# EAGLE design Omni-BASIC-BOTTOM (EAGLE 9.6.2)
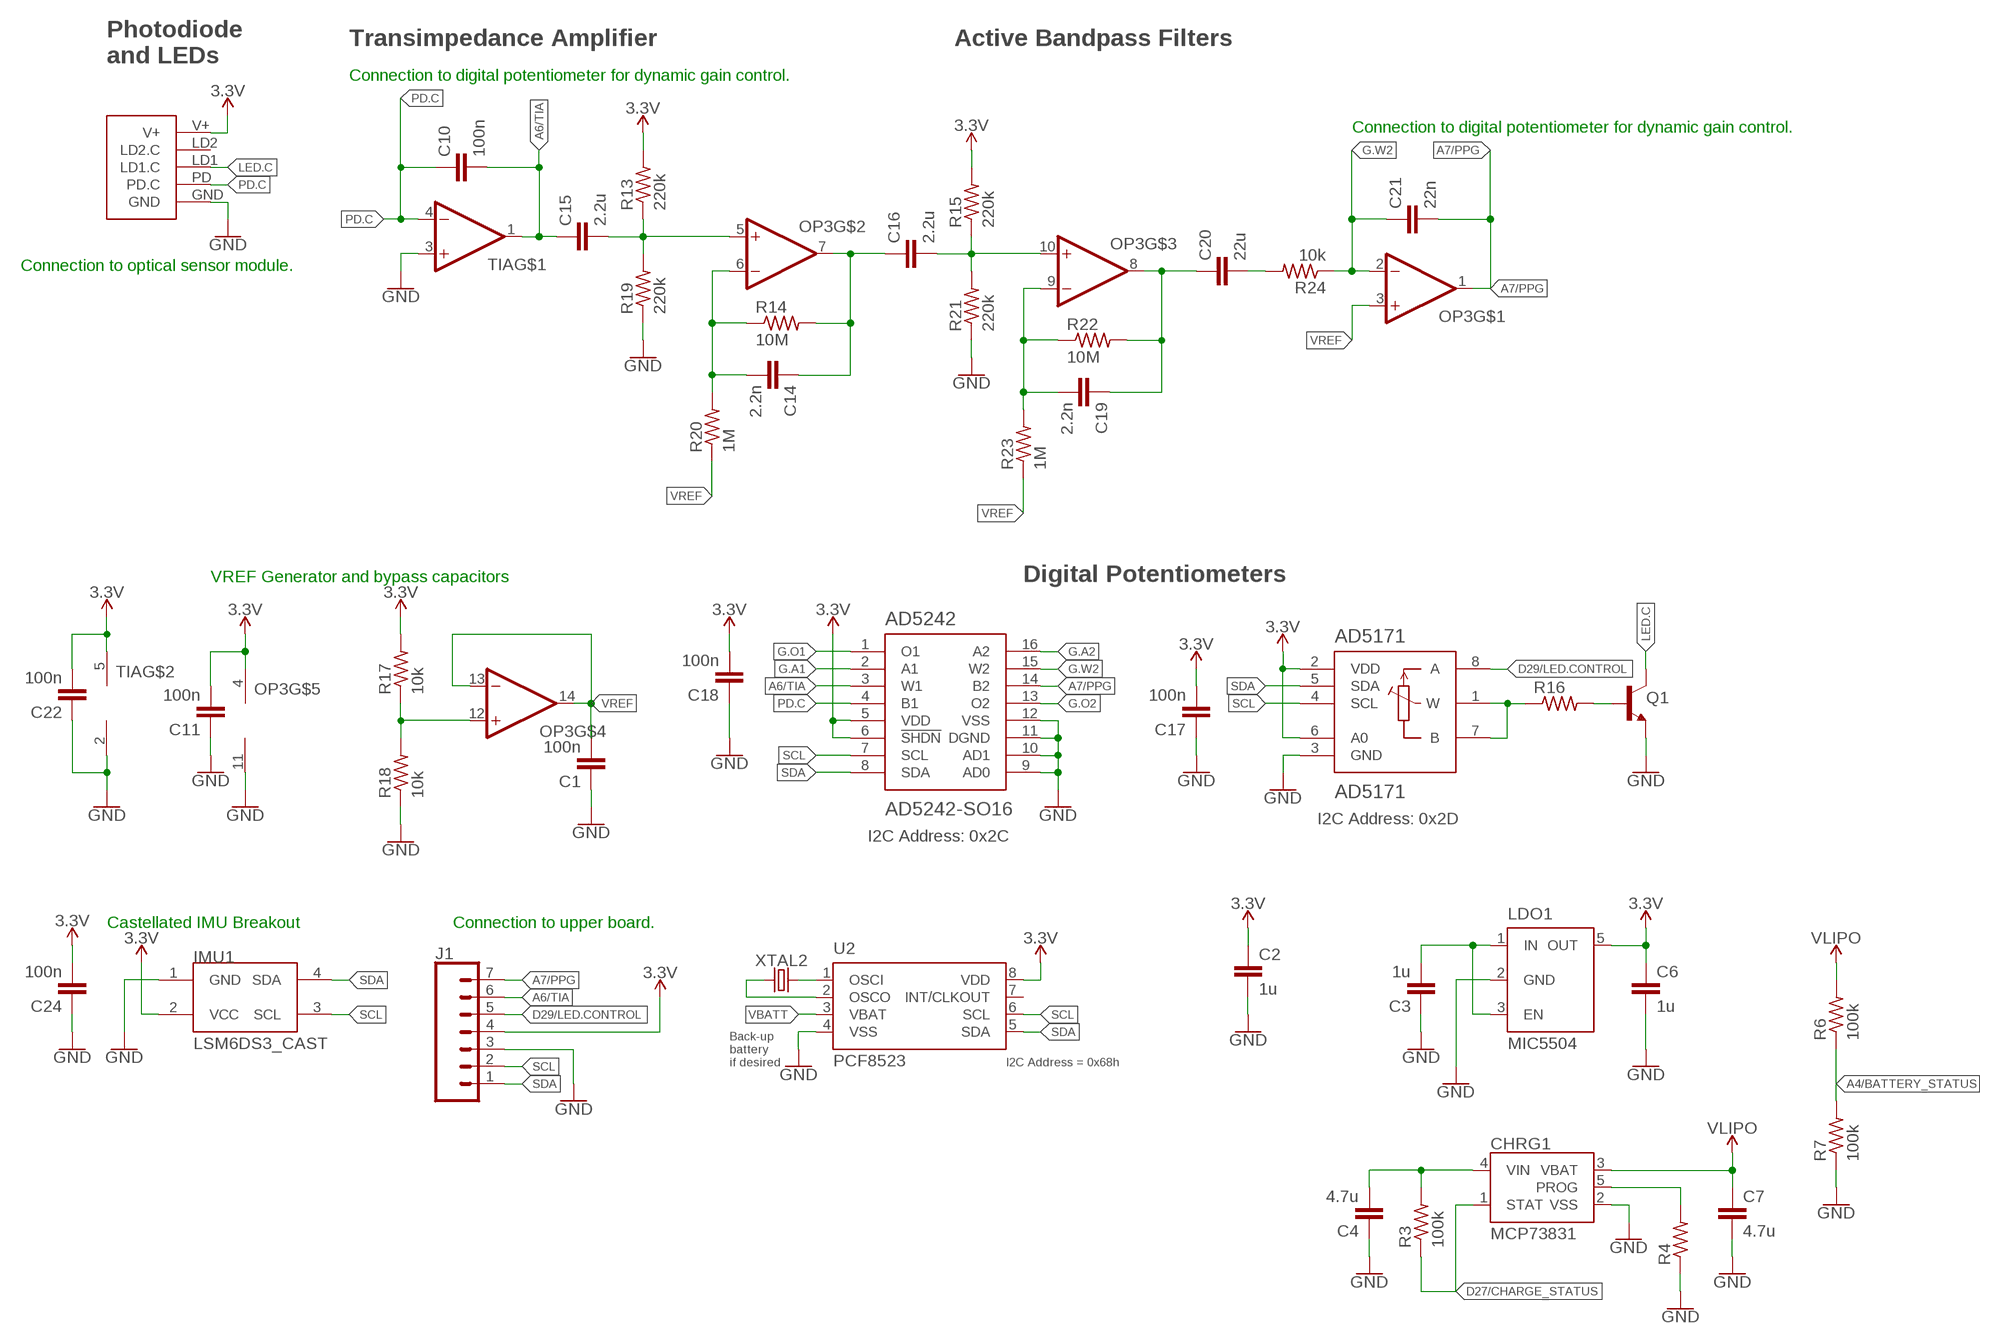
[diagram p0: schematic, sheet 1]

## Parts
AD5171  AD5171  [SOT-23-8]
AD5242  AD5242-SO16  [SO16]
C1  100n  CAPACITOR0603  [C0603]
C2  1u  CAPACITOR0603  [C0603]
C3  1u  CAPACITOR0603  [C0603]
C4  4.7u  CAPACITOR0603  [C0603]
C6  1u  CAPACITOR0603  [C0603]
C7  4.7u  CAPACITOR0603  [C0603]
C10  100n  CAPACITOR0603  [C0603]
C11  100n  CAPACITOR0603  [C0603]
C14  2.2n  CAPACITOR0603  [C0603]
C15  2.2u  CAPACITOR0603  [C0603]
C16  2.2u  CAPACITOR0603  [C0603]
C17  100n  CAPACITOR0603  [C0603]
C18  100n  CAPACITOR0603  [C0603]
C19  2.2n  CAPACITOR0603  [C0603]
C20  22u  CAPACITOR0603  [C0603]
C21  22n  CAPACITOR0603  [C0603]
C22  100n  CAPACITOR0603  [C0603]
C24  100n  CAPACITOR0603  [C0603]
CHRG1  MCP73831  [SOT23-5]
IMU1  LSM6DS3_CAST  [LSM6DS3_CAST]
J1  CONN_07-1.27MM  [1X07_1.27MM]
LDO1  MIC5504  [SOT23-5]
OP3  OP-QUAD-SO14  [SO14]
Q1  NPN-GENERIC  [SOT23-3]
R3  100k  RESISTOR0603  [R0603]
R4  RESISTOR0603  [R0603]
R6  100k  RESISTOR0603  [R0603]
R7  100k  RESISTOR0603  [R0603]
R13  220k  RESISTOR0603  [R0603]
R14  10M  RESISTOR0603  [R0603]
R15  220k  RESISTOR0603  [R0603]
R16  RESISTOR0603  [R0603]
R17  10k  RESISTOR0402  [R0402]
R18  10k  RESISTOR0402  [R0402]
R19  220k  RESISTOR0603  [R0603]
R20  1M  RESISTOR0603  [R0603]
R21  220k  RESISTOR0603  [R0603]
R22  10M  RESISTOR0603  [R0603]
R23  1M  RESISTOR0603  [R0603]
R24  10k  RESISTOR0603  [R0603]
TIA  OP-SINGLEOT  [SOT23-5]
U2  PCF8523  [SO8]
U$3  PPG.MODULE.2  [PPG.MODULE.2]
XTAL2  32.7680kHz  CRYSTALECS-.327-12.5-12-C-TR  [2-SMD.NOLEAD.2.0MMTO1.2MM]

## Nets
3.3V: AD5171.2(VDD) AD5171.6(A0) AD5242.5(VDD) AD5242.6(!SHDN) C2.1 C6.1 C11.2 C17.2 C18.2 C22.2 C24.2 IMU1.2(VCC) J1.4 LDO1.5(OUT) OP3.4(V+) R13.2 R15.2 R17.2 TIA.5(V+) U2.8(VDD) U$3.V+
A4/BATTERY_STATUS: R6.1 R7.2
A6/TIA: AD5242.3(W1) C10.2 C15.1 J1.6 TIA.1(OUT)
A7/PPG: AD5242.14(B2) C21.2 J1.7 OP3.1(OUT)
D27/CHARGE_STATUS: CHRG1.1(STAT) R3.1
D29/LED.CONTROL: AD5171.8(A) J1.5
G.A1: AD5242.2(A1)
G.A2: AD5242.16(A2)
G.O1: AD5242.1(O1)
G.O2: AD5242.13(O2)
G.W2: AD5242.15(W2) C21.1 OP3.2(-IN) R24.1
GND: AD5171.3(GND) AD5242.9(AD0) AD5242.10(AD1) AD5242.11(DGND) AD5242.12(VSS) C1.1 C2.2 C3.1 C4.1 C6.2 C7.2 C11.1 C17.1 C18.1 C22.1 C24.1 CHRG1.2(VSS) IMU1.1(GND) J1.3 LDO1.2(GND) OP3.11(V-) Q1.2(E) R4.1 R7.1 R18.1 R19.1 R21.1 TIA.2(V-) TIA.3(+IN) U2.4(VSS) U$3.GND
LED.C: Q1.3(C) U$3.LD1(LD1.C)
N$3: U2.2(OSCO) XTAL2.P$1
N$4: U2.1(OSCI) XTAL2.P$2
N$5: CHRG1.5(PROG) R4.2
N$6: C3.2 LDO1.1(IN) LDO1.3(EN)
N$8: Q1.1(B) R16.2
N$9: AD5171.1(W) AD5171.7(B) R16.1
N$10: OP3.12(+IN) R17.1 R18.2
N$13: C15.2 OP3.5(+IN) R13.1 R19.2
N$15: C14.2 OP3.6(-IN) R14.1 R20.2
N$16: C14.1 C16.1 OP3.7(OUT) R14.2
N$17: C16.2 OP3.10(+IN) R15.1 R21.2
N$18: C19.2 OP3.9(-IN) R22.1 R23.2
N$19: C19.1 C20.1 OP3.8(OUT) R22.2
N$20: C20.2 R24.2
PD.C: AD5242.4(B1) C10.1 TIA.4(-IN) U$3.PD(PD.C)
SCL: AD5171.4(SCL) AD5242.7(SCL) IMU1.3(SCL) J1.2 U2.6(SCL)
SDA: AD5171.5(SDA) AD5242.8(SDA) IMU1.4(SDA) J1.1 U2.5(SDA)
VBATT: U2.3(VBAT)
VIN1: C4.2 CHRG1.4(VIN) R3.2
VLIPO: C7.1 CHRG1.3(VBAT) R6.2
VREF: C1.2 OP3.3(+IN) OP3.13(-IN) OP3.14(OUT) R20.1 R23.1
Unconnected: U2.7(INT/CLKOUT) U$3.LD2(LD2.C)

## Notes on the sheet
- Transimpedance Amplifier | Active Bandpass Filters
- Photodiode
  and LEDs
- Connection to digital potentiometer for dynamic gain control.
- Connection to digital potentiometer for dynamic gain control.
- Connection to optical sensor module.
- VREF Generator and bypass capacitors | Digital Potentiometers
- I2C Address: 0x2D
- I2C Address: 0x2C
- Castellated IMU Breakout | Connection to upper board.
- Back-up
  battery
  if desired
- I2C Address = 0x68h

## Library data of the parts
AD5171 = LinnesLab-DigitalIC:AD5171
AD5242 = LinnesLab-DigitalIC:AD5242
C1-C4 C6 C7 C10 C11 C14-C22 C24 = LinnesLab-Passives:CAPACITOR
CHRG1 = LinnesLab-Power:MCP73831: MCP73831T Li-Ion, Li-Pol Controller Miniature single cell, fully integrated Li-Ion, Li-polymer charge management controller Datasheet <http://ww1.microchip.com/downloads/en/DeviceDoc/20001984g.pdf> SparkFun Products: SparkFun ESP32 Thing <https://www.sparkfun.com/products/13907> SparkFun 9DoF Razor IMU M0 <https://www.sparkfun.com/products/14001>; PROD_ID: IC-09995
IMU1 = LinnesLab-Sensors:LSM6DS3_CAST
J1 = LinnesLab-Connectors:CONN_07: Multi connection point. Often used as Generic Header-pin footprint for 0.1 inch spaced/style header connections On any of the 0.1 inch spaced packages, you can populate with these: Break Away Headers - Straight <https://www.sparkfun.com/products/116> (PRT-00116) Break Away Male Headers - Right Angle <https://www.sparkfun.com/products/553> (PRT-00553) Female Headers <https://www.sparkfun.com/products/115> (PRT-00115) Break Away Headers - Machine Pin <https://www.sparkfun.com/products/117> (PRT-00117) Break Away Female Headers - Swiss Machine Pin <https://www.sparkfun.com/products/743> (PRT-00743) For SCREWTERMINALS and SPRING TERMINALS visit here: Screw Terimnals on SparkFun.com <https://www.sparkfun.com/search/results?term=Screw+Terminals> (5mm/3.5mm/2.54mm spacing) This device is also useful as a general connection point to wire up your design to another part of your project. Our various solder wires solder well into these plated through hole pads. Hook-Up Wire - Assortment (Stranded, 22 AWG) <https://www.sparkfun.com/products/11375> (PRT-11375) Hook-Up Wire - Assortment (Solid Core, 22 AWG) <https://www.sparkfun.com/products/11367> (PRT-11367) View the entire wire category on our website here <https://www.sparkfun.com/categories/141> Special notes: Molex polarized connector foot print use with SKU : PRT-08231 with associated crimp pins and housings. 1MM SMD Version SKU: PRT-10208 NOTES ON THE VARIANTS LOCK and LOCK_LONGPADS... This footprint was designed to help hold the alignment of a through-hole component (i.e. 6-pin header) while soldering it into place. You may notice that each hole has been shifted either up or down by 0.005 of an inch from it's more standard position (which is a perfectly straight line). This slight alteration caused the pins (the squares in the middle) to touch the edges of the holes. Because they are alternating, it causes a "brace" to hold the component in place. 0.005 has proven to be the perfect amount of "off-center" position when using our standard breakaway headers. Although looks a little odd when you look at the bare footprint, once you have a header in there, the alteration is very hard to notice. Also,if you push a header all the way into place, it is covered up entirely on the bottom side.
LDO1 = LinnesLab-Power:MIC5504: MIC5504 Voltage Regulator Output Voltages: 1.0V to 3.3V Input Voltages: 2.5V to 5.5V Link to Datasheet http://ww1.microchip.com/downloads/en/DeviceDoc/MIC550X.pdf
OP3 = LinnesLab-AnalogIC:OP-QUAD: General symbol and footprints for Quad Op Amps. Use with any standard general purpose op amp.
Q1 = LinnesLab-DiscreteSemi:NPN
R3 R4 R6 R7 R13-R24 = LinnesLab-Passives:RESISTOR
TIA = LinnesLab-AnalogIC:OP-SINGLE: Single Op Amp 2.7V to 6.0V Single Supply CMOS Source: http://ww1.microchip.com/downloads/en/DeviceDoc/21314g.pdf
U2 = LinnesLab-Clocks:PCF8523; DIGIKEY: 568-5306-1-ND; I2C_ADDRESS: 0x68h; MFN: PCF8523T/1,118; MFN_MANUFACTURER: NXP USA Inc.
U$3 = LinnesLab-Connectors:PPG.MODULE.2: Digi-Key Part Number: S9014E-50-ND Manufacturer Part Number: GRPB501VWVN-RC Description: 1mm insulation height 0.05in pitch 50 positions
XTAL2 = LinnesLab-Clocks:CRYSTAL; DIGIKEY: XC2288CT-ND; FREQ: 32.7680KHZ; LOAD_CAP: 12.5pF

## Board
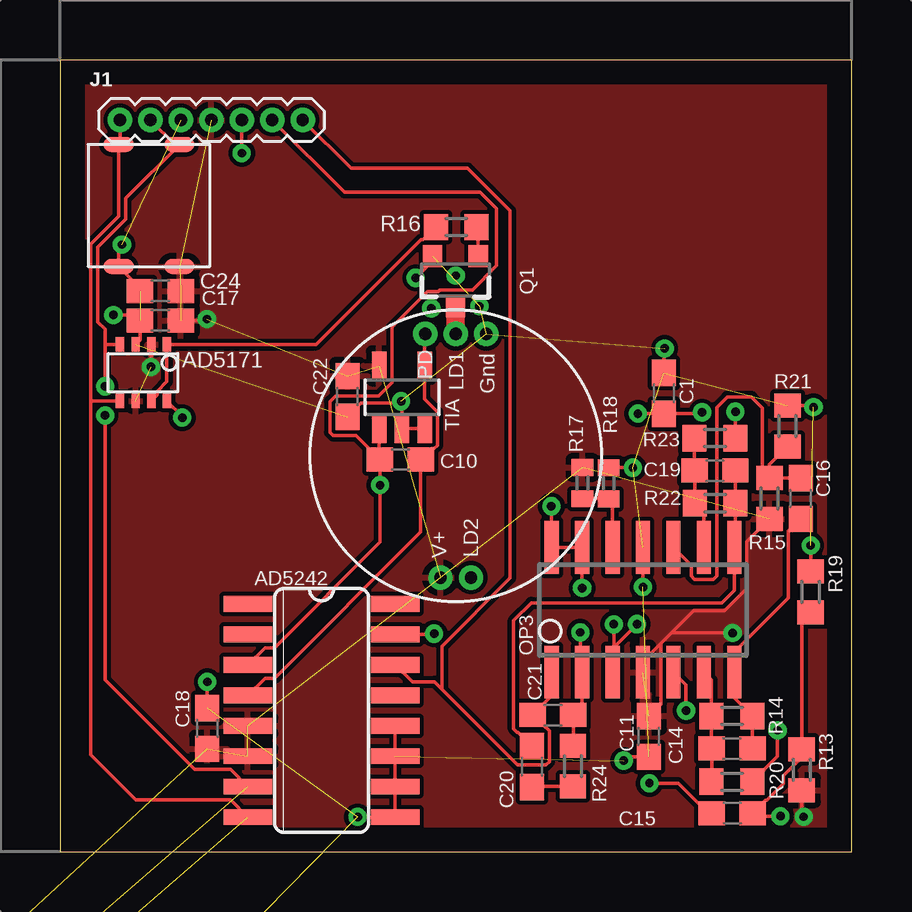
[diagram p1: board, top side]
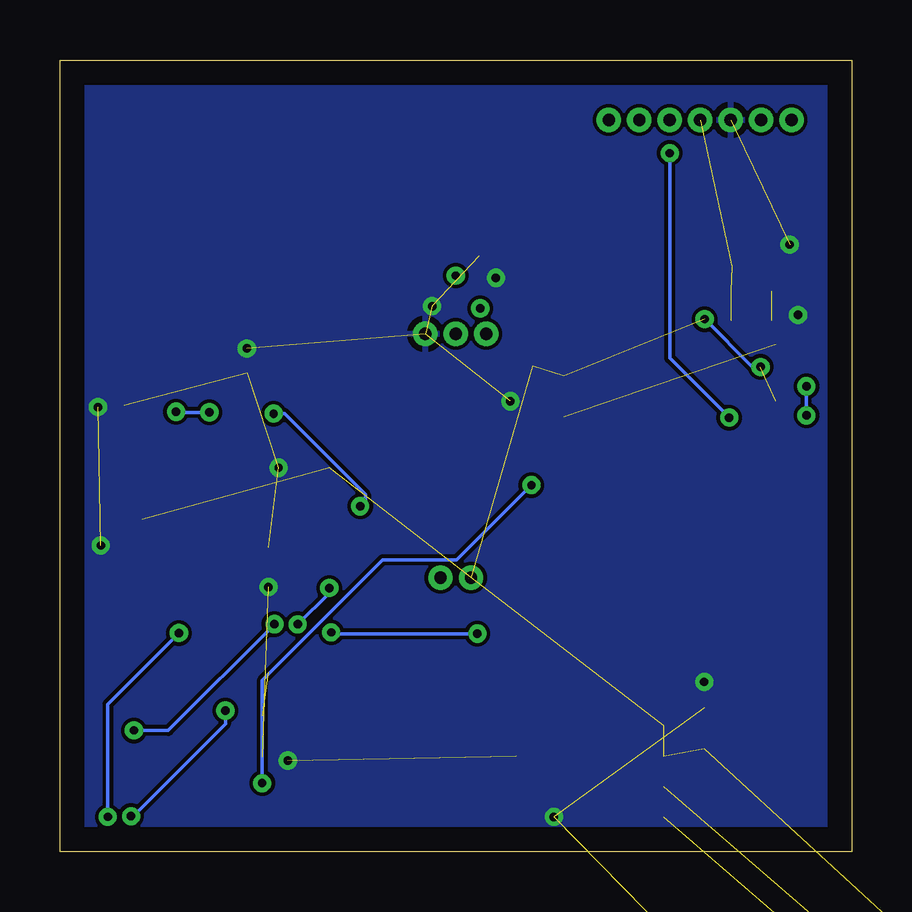
[diagram p2: board, bottom side, seen from below]

Size 33 x 33 mm. Coordinates in mm from the lower left corner, seen from the top.
Outline: 0,0 33,0 33,33 0,33 0,0
Copper layers (1*16): Top 0.035mm / dielectric 1.5mm / Bottom 0.035mm
Design rules "default": minimum track width 6mil, minimum drill 0.35mm, track to track 6mil, track to pad 6mil, pad to pad 6mil, via to via 6mil, smd to smd 6mil, copper to edge 40mil, drill to drill 6mil, minimum pad ring 10mil, minimum via ring 8mil, stop-mask expansion 4mil, vias tented up to drill 0mil, thermal gap 10mil

### Footprints (pad centres in the part's own frame; a part is rotated, then mirrored left to right if it is on the bottom)
SOT-23-8 = smd 0.35 x 0.6: 1 -0.991,-1.176; 2 -0.341,-1.176; 3 0.309,-1.176; 4 0.959,-1.176; 5 0.959,1.176; 6 0.309,1.176; 7 -0.341,1.176; 8 -0.991,1.176
SO16 = smd 0.66 x 2.032: 1 -4.445,-3.073; 2 -3.175,-3.073; 3 -1.905,-3.073; 4 -0.635,-3.073; 5 0.635,-3.073; 6 1.905,-3.073; 7 3.175,-3.073; 8 4.445,-3.073; 9 4.445,3.073; 10 3.175,3.073; 11 1.905,3.073; 12 0.635,3.073; 13 -0.635,3.073; 14 -1.905,3.073; 15 -3.175,3.073; 16 -4.445,3.073
C0603 = smd 1.1 x 1: 1 -0.85,0; 2 0.85,0
SOT23-5 = smd 0.55 x 1.2: 1 -0.95,-1.3; 2 0,-1.3; 3 0.95,-1.3; 4 0.95,1.3; 5 -0.95,1.3
LSM6DS3_CAST = smd 0.635 x 1.27: 1 -2.54,1.27; 2 -2.54,-1.27; 3 2.54,-1.27; 4 2.54,1.27
1X07_1.27MM = drill 0.508 pad 1: 1 0,0; 2 1.27,0; 3 2.54,0; 4 3.81,0; 5 5.08,0; 6 6.35,0; 7 7.62,0
SO14 = smd 0.6 x 2.2: 1 -3.81,-2.6; 2 -2.54,-2.6; 3 -1.27,-2.6; 4 0,-2.6; 5 1.27,-2.6; 6 2.54,-2.6; 7 3.81,-2.6; 8 3.81,2.6; 9 2.54,2.6; 10 1.27,2.6; 11 0,2.6; 12 -1.27,2.6; 13 -2.54,2.6; 14 -3.81,2.6
SOT23-3 = smd 0.8 x 0.9: 1 -0.95,-1; 2 0.95,-1; 3 0,1.1
R0603 = smd 1 x 1.1: 1 -0.85,0; 2 0.85,0
R0402 = smd 0.7 x 0.9: 1 -0.65,0; 2 0.65,0
SOT23-5' = smd 0.6 x 1.2: 1 -0.95,-1.306; 2 0,-1.306; 3 0.95,-1.306; 4 0.95,1.306; 5 -0.95,1.306
SO8 = smd 1.3 x 0.6: 1 -2.65,1.905; 2 -2.65,0.635; 3 -2.65,-0.635; 4 -2.65,-1.905; 5 2.65,-1.905; 6 2.65,-0.635; 7 2.65,0.635; 8 2.65,1.905
PPG.MODULE.2 = drill 0.508 pad 0.94: GND 1.27,5.08; LD1 0,5.08; LD2 0.635,-5.08; PD -1.27,5.08; V+ -0.635,-5.08
2-SMD.NOLEAD.2.0MMTO1.2MM = smd 0.7 x 1.3: P$1 -0.8,0; P$2 0.8,0

### Placement (x,y rotation side)
AD5171  3.47,19.97 180 top
AD5242  10.9,5.88 270 top
C1  25.17,19.1 270 top
C2  -1.86,-12.26 0 top  (outside the outline)
C3  -5.05,-25.19 0 top  (outside the outline)
C4  -1.52,-21.12 0 top  (outside the outline)
C6  -2.04,-25.19 0 top  (outside the outline)
C7  -8.13,-25.19 0 top  (outside the outline)
C10  14.19,16.35 180 top
C11  24.56,4.8 90 top
C14  28.02,4.3 180 top
C15  28.02,1.59 0 top
C16  30.88,14.72 90 top
C17  4.19,22.14 0 top
C18  6.13,5.13 270 top
C19  27.31,15.89 180 top
C20  19.67,3.54 270 top
C21  20.55,5.7 180 top
C22  11.99,18.97 90 top
C24  4.19,23.37 0 top
CHRG1  -6.82,-17.07 0 top  (outside the outline)
IMU1  3.71,26.93 90 top
J1  2.5,30.5 0 top
LDO1  -6.82,-29.61 0 top  (outside the outline)
OP3  24.3,10.08 0 top
Q1  16.49,23.82 180 top
R3  -2.28,-16.34 0 top  (outside the outline)
R4  -2.28,-29.27 0 top  (outside the outline)
R6  -8.14,-21.12 0 top  (outside the outline)
R7  -4.83,-21.12 0 top  (outside the outline)
R13  30.92,3.41 270 top
R14  28.02,5.65 0 top
R15  29.58,14.72 270 top
R16  16.52,26.03 0 top
R17  21.78,15.36 90 top
R18  22.88,15.35 270 top
R19  31.29,10.82 270 top
R20  28.02,2.91 180 top
R21  30.33,17.74 270 top
R22  27.31,14.52 0 top
R23  27.3,17.23 180 top
R24  21.39,3.56 270 top
TIA  [SOT23-5']  14.26,18.94 0 top
U2  -6.23,-6.53 0 top  (outside the outline)
U$3  16.5,16.5 0 top
XTAL2  -7.29,-12.47 0 top  (outside the outline)

### Tracks (layer width: path | path; a pad name or v marks a point on that pad's centre or on a via)
3.3V  (via drill 0.35)  (17 unrouted)
  Top 0.152: R15.2 28.64,12.94 28.64,10.98 27.73,10.06 26.43,10.06 24.3,7.93 OP3.4 | C17.2 6.06,22.14 v6.12,22.2 | v3.79,20.2 3.79,21.13 AD5171.2 | C11.2 25.05,6.13 25.05,8.67 25.48,9.11 v28.04,9.11 | v31.01,1.45 30.92,1.53 R13.2
  Bottom 0.152: v6.12,22.2 4.13,20.2 v3.79,20.2 | v28.04,9.11 31.01,6.14 v31.01,1.45
  pour Top (isolate 0.178): 0.5,32.5 32.5,32.5 32.5,0.5 0.5,0.5
A4/BATTERY_STATUS  (1 unrouted)
A6/TIA  (via drill 0.35)
  Top 0.152: C10.2 v13.34,15.28 v13.35,15.27 13.35,12.9 8.94,8.5 8.54,8.5 AD5242.3 | C15.1 27.03,1.59 25.78,2.85 v24.57,2.85 | J1.6 11.86,27.49 17.52,27.49 18.2,26.8 18.2,24.42 17.19,23.4 15.83,23.4 15.77,23.35 15.32,23.35 13.83,21.86 13.83,19.55 13.28,19 11.49,19 11.26,18.77 11.26,17.48 11.39,17.34 12.35,17.34 C10.2 | TIA.1 13.3,16.39 C10.2
  Bottom 0.152: v13.35,15.27 16.46,12.16 19.55,12.16 24.57,7.13 v24.57,2.85
A7/PPG
  Top 0.152: OP3.1 20.49,6.49 C21.2 20.23,5.17 20.26,5.17 20.4,5.04 20.4,3.75 20.26,3.61 19.07,3.61 15.92,6.76 | AD5242.14 14.69,7.07 15.61,7.07 15.92,6.76 | J1.7 12.13,28.49 17,28.49 18.77,26.72 18.77,11.4 15.92,8.55 15.92,6.76
D27/CHARGE_STATUS  (1 unrouted)
D29/LED.CONTROL  (via drill 0.35)
  Top 0.152: AD5171.8 5.1,18.15 v5.1,18.09 | v7.58,29.11 v7.58,29.12 J1.5
  Bottom 0.152: v5.1,18.09 7.58,20.57 v7.58,29.11
G.W2  (via drill 0.35)
  Top 0.152: R24.1 21.4,4.43 C21.1 21.76,6.06 OP3.2 21.69,7.55 v21.69,9.14 | AD5242.15 15.57,9.06 v15.6,9.08
  Bottom 0.152: v15.6,9.08 21.64,9.08 v21.69,9.14
GND  (via drill 0.35)  (24 unrouted)
  Top 0.152: R18.1 v23.89,16 | v23.89,16 | OP3.11 v24.3,11.03 v24.31,11.03 | v31.41,18.53 31.35,18.59 R21.1 | v31.3,12.76 R19.1 | C11.1 23.66,3.95 v23.5,3.79 | C18.1 v6.13,7.06 v6.14,7.07 | 14.25,18.69 TIA.2 TIA.3 | 14.25,18.69 14.25,18.74 v14.22,18.77 | C22.1 12.56,18.69 14.25,18.69 | AD5242.12 AD5242.11 AD5242.10 AD5242.9 v12.42,1.44 v12.41,1.44 | v2.58,25.3 2.44,25.16 IMU1.1 3.34,23.5 C24.1 | Q1.2 15.54,24.62 v14.83,23.92 | AD5171.3 3.34,21.32 C17.1 3.11,22.37 v2.23,22.37 | C1.1 25.17,20.94 v25.21,20.98
  other vias: 17.48,22.74
  pour Bottom: 0.31,32.75 32.83,32.75 32.83,32.72 32.83,0.23 32.83,0.19 0.28,0.19 0.28,32.72 0.33,32.72
LED.C
  Top 0.762: Q1.3 16.49,21.59 U$3.LD1
N$1  (via drill 0.35)
  other vias: 16.5,24.01
N$2  (via drill 0.35)
  other vias: 15.48,22.65
N$3  (1 unrouted)
N$4  (1 unrouted)
N$5  (1 unrouted)
N$6  (2 unrouted)
N$8
  Top 0.152: R16.2 17.44,25.96 Q1.1
N$9
  Top 0.152: R16.1 15.14,25.5 15.04,25.5 10.68,21.14 AD5171.1 4.46,19.59 4.05,19.18 4.05,19.04 AD5171.7
N$10
  Top 0.152: R17.1 22.86,14.71 R18.2 23.03,14.54 OP3.12
N$13  (via drill 0.35)
  Top 0.152: R19.2 30.92,9.61 R13.1 30.92,3.93 30.15,3.16 30.15,2.82 29.46,2.13 29.41,2.13 C15.2 28.99,1.48 v30.04,1.48 | OP3.5 26.1,6.95 v26.1,5.87
  Bottom 0.152: v26.1,5.87 26.1,5.32 29.95,1.48 v30.04,1.48
N$15
  Top 0.152: OP3.6 27.17,7.15 R14.1 C14.2 R20.2
N$16
  Top 0.152: C14.1 R14.2 28.11,6.4 OP3.7 28.11,8.32 30.37,10.58 30.37,13.36 C16.1
N$17
  Top 0.152: R15.1 C16.2 | R21.2 29.58,16.14 R15.1 | OP3.10 26.32,11.94 26.32,11.48 26.45,11.35 27.24,11.35 27.38,11.49 27.38,18.52 27.82,18.95 28.82,18.95 29.28,18.5 29.28,15.87 R15.1
N$18
  Top 0.152: OP3.9 26.84,14.14 R22.1 C19.2 R23.2
N$19
  Top 0.152: C20.1 19.09,4.97 19.06,4.97 18.91,5.12 18.91,9.63 19.65,10.37 27.6,10.37 28.11,10.88 OP3.8 28.16,12.72 R22.2 C19.1
N$20
  Top 0.152: R24.2 19.69,2.71 C20.2
PD.C
  Top 0.152: U$3.PD 15.2,21.55 TIA.4 15.2,18.86 15.73,18.33 15.73,16.94 15.6,16.8 15.49,16.8 C10.1 15.04,13.33 8.94,7.23 8.54,7.23 AD5242.4
SCL  (via drill 0.35)  (1 unrouted)
  Top 0.152: J1.2 4.8,29.47 IMU1.3 2.75,27.24 2.75,26.36 1.58,25.19 1.58,22.08 1.88,21.78 1.88,21.15 | AD5242.7 7.12,3.42 5.62,3.42 1.88,7.16 v1.88,18.18 | v1.88,19.4 1.88,21.15 | AD5171.4 1.89,21.14 1.88,21.15
  Bottom 0.152: v1.88,18.18 v1.88,19.4
SDA  (1 unrouted)
  Top 0.152: J1.1 2.5,29.53 IMU1.4 2.44,26.48 1.27,25.31 1.27,18.76 | AD5242.8 7.12,2.15 3.16,2.15 1.27,4.04 1.27,18.76 | AD5171.5 1.31,18.79 1.27,18.76
VIN1  (2 unrouted)
VLIPO  (2 unrouted)
VREF  (via drill 0.35)
  Top 0.152: v20.49,14.39 OP3.14 OP3.13 v21.76,10.99 v21.77,10.98 | v28.16,18.33 28.16,17.91 R23.1 | v23.09,9.47 23.09,7.53 OP3.3 23.03,8.45 v24.06,9.48 | v29.91,5.05 29.91,3.96 R20.1 | v24.09,18.26 C1.2 26.71,18.25 v26.77,18.31
  Bottom 0.152: v24.09,18.26 v24.09,18.27 23.64,18.27 20.26,14.88 20.26,14.62 v20.49,14.39 | v28.16,18.34 v28.16,18.33 28.14,18.31 v26.77,18.31 | v21.77,10.98 21.77,10.79 v23.09,9.47 | v24.06,9.48 28.49,5.05 v29.91,5.05